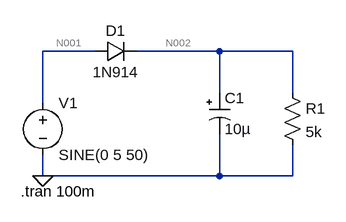
[diagram p0: schematic Draft2.asc]
Draft2.asc, the LTspice schematic file:
Version 4
SHEET 1 880 680
WIRE 144 64 64 64
WIRE 336 64 208 64
WIRE 448 64 336 64
WIRE 336 128 336 64
WIRE 448 128 448 64
WIRE 64 144 64 64
WIRE 64 256 64 224
WIRE 336 256 336 192
WIRE 336 256 64 256
WIRE 448 256 448 208
WIRE 448 256 336 256
FLAG 64 256 0
SYMBOL voltage 64 128 R0
WINDOW 123 0 0 Left 0
WINDOW 39 0 0 Left 0
SYMATTR InstName V1
SYMATTR Value SINE(0 5 50)
SYMBOL diode 144 80 R270
WINDOW 0 32 32 VTop 2
WINDOW 3 0 32 VBottom 2
SYMATTR InstName D1
SYMATTR Value 1N914
SYMBOL polcap 320 128 R0
SYMATTR InstName C1
SYMATTR Value 10µ
SYMBOL res 432 112 R0
SYMATTR InstName R1
SYMATTR Value 5k
TEXT 30 280 Left 2 !.tran 100m

The netlist it stands for:
* Draft2.asc
V1 N001 0 SINE(0 5 50)
D1 N001 N002 1N914
C1 N002 0 10µ
R1 N002 0 5k
.model D D
.lib standard.dio
.tran 100m
.backanno
.end

* Results of the author's LTspice run, read from the files saved beside the schematic
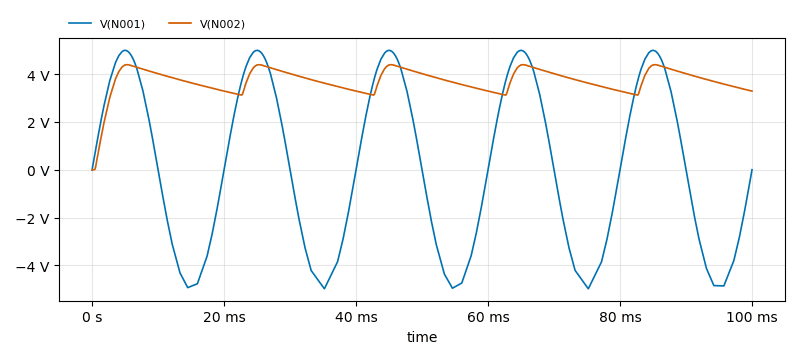
[diagram p1: Transient Analysis of Draft2.asc, plotted from the saved traces]
* Transient Analysis, 1 run:
*   V(N001): min -4.986 V, max 5 V, average 22.29 mV, rms 3.515 V, last 0 V
*   V(N002): min 0 V, max 4.4 V, average 3.712 V, rms 3.756 V, last 3.294 V